# Altium schematic sheet Э2_diplom.SchDoc
size 420 x 297 mm; CheckedBy: Резчикова Е.В.; Author: Аракелян Г.Г.; CompanyName: ИУ4.11.03.03.25.01.82.08.001 Э2; Address1: Схема электрическая функциональная; SheetNumber: 2; SheetTotal: 3
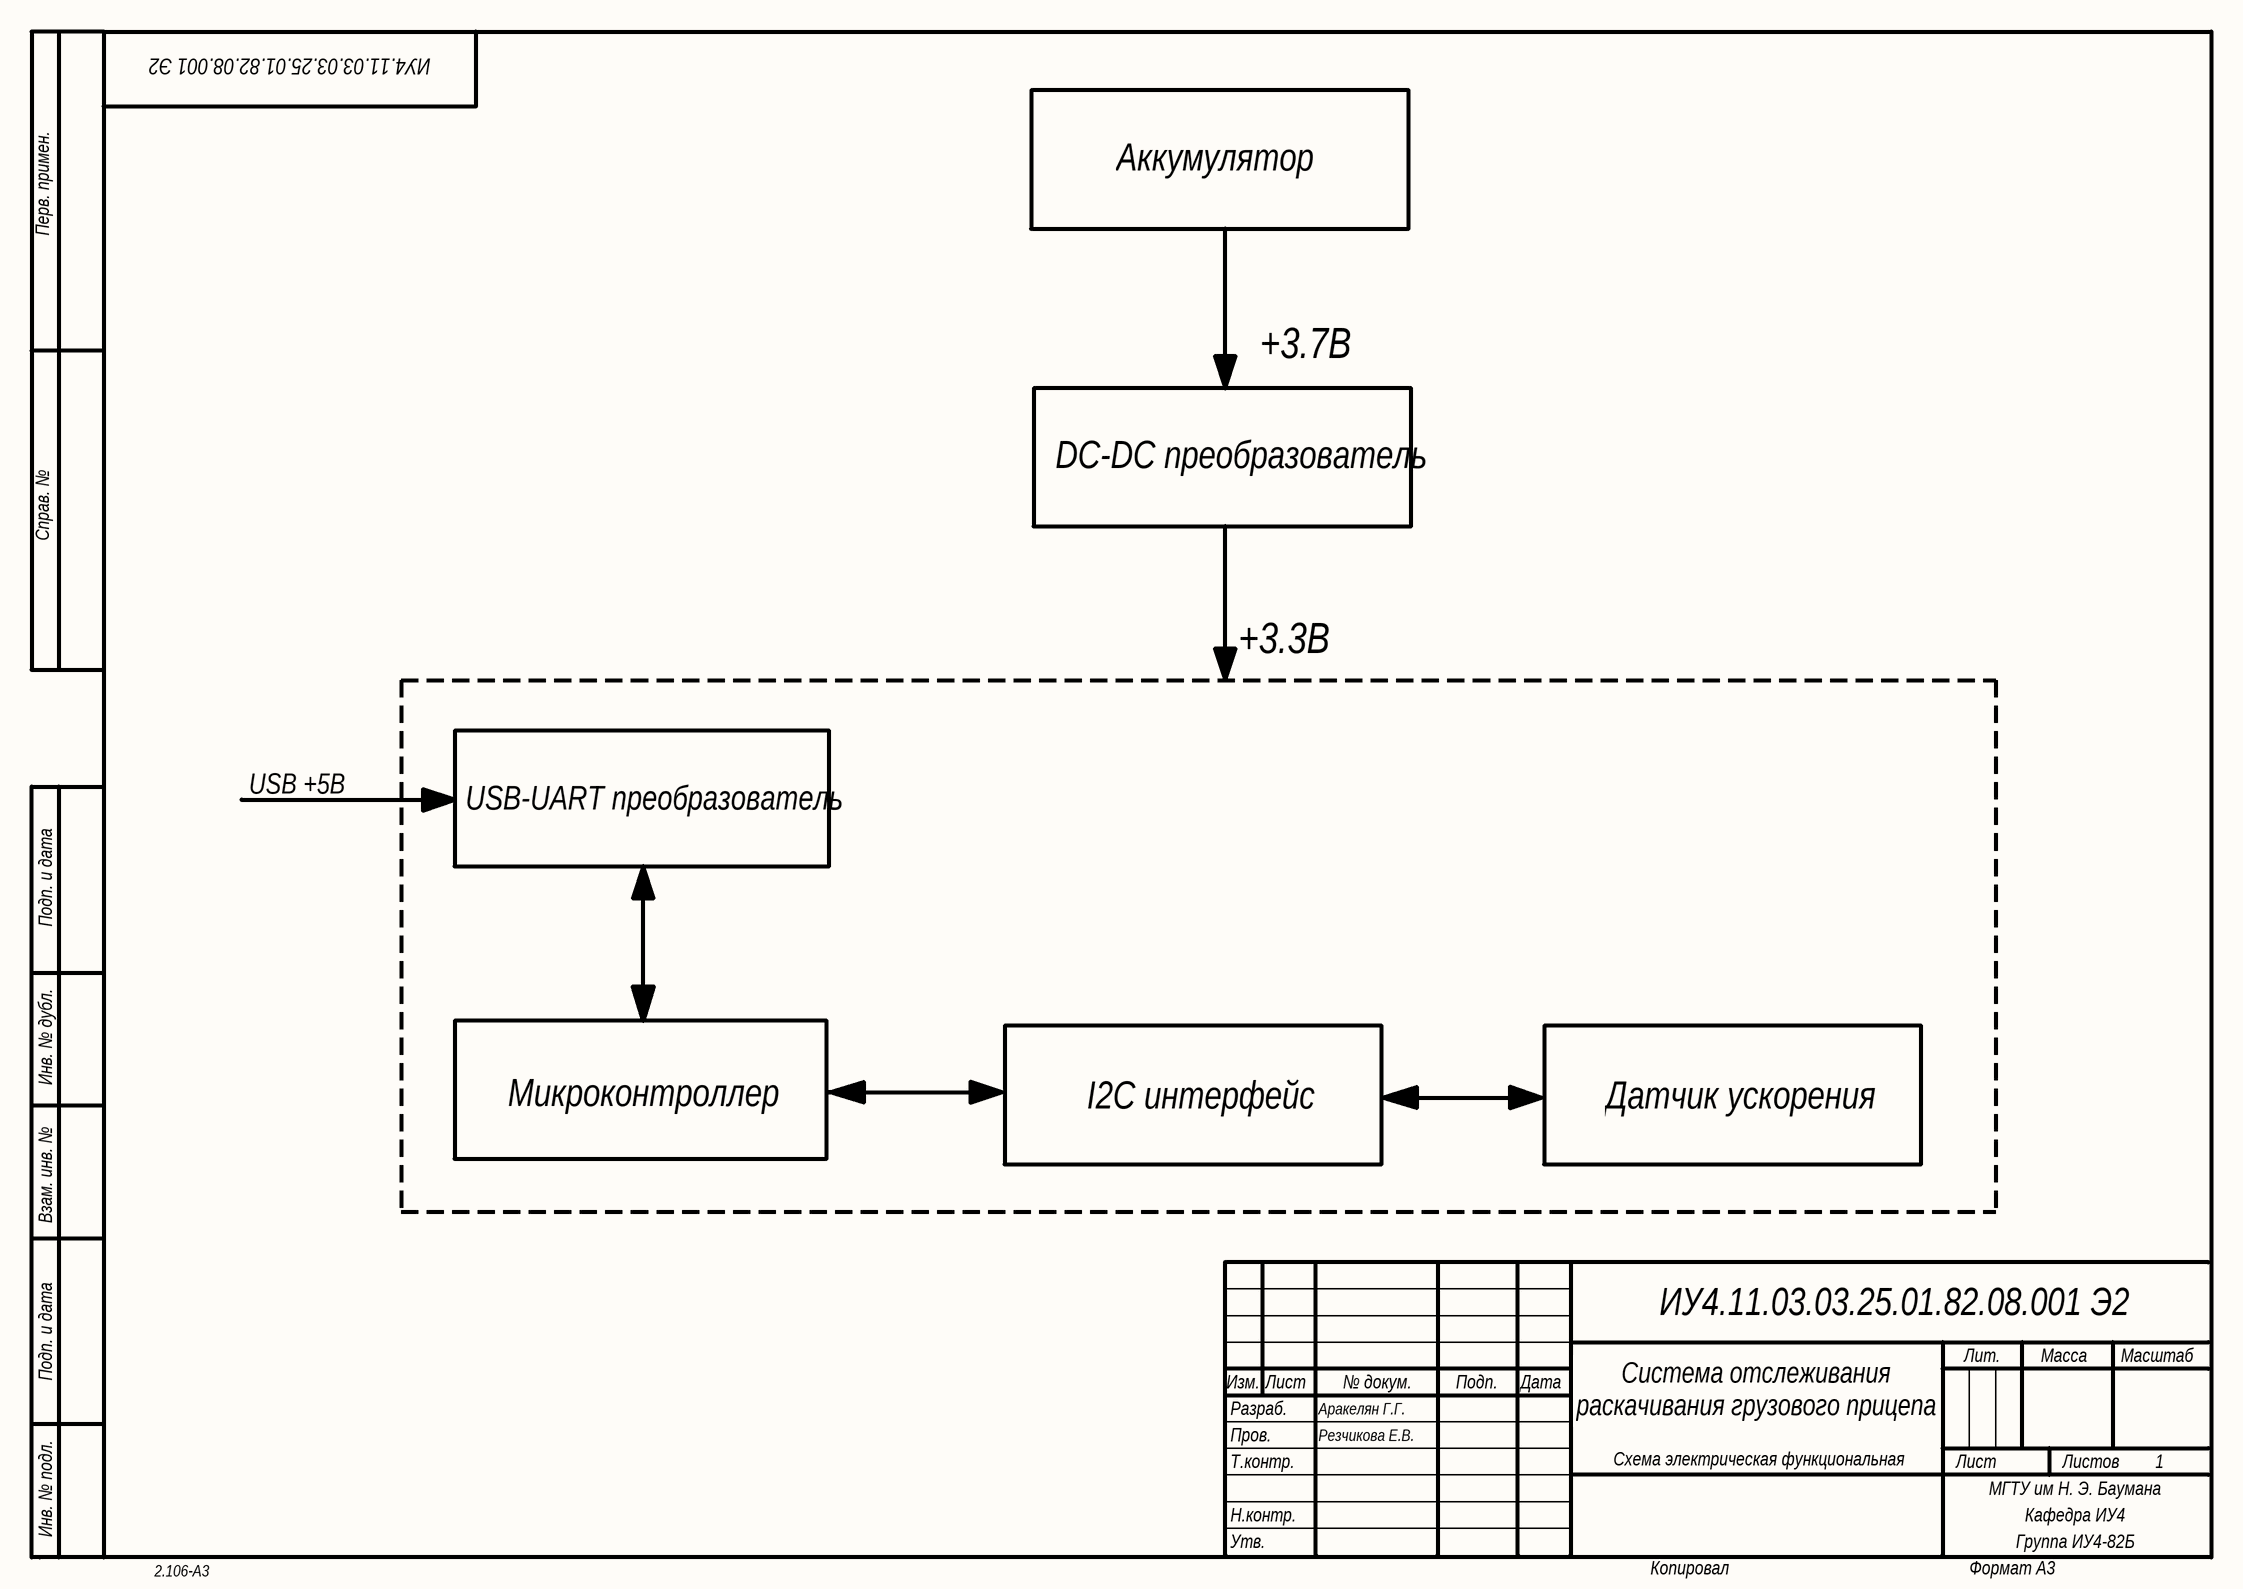
[diagram p0: Э2_diplom.SchDoc]

## Notes on the sheet
- Аккумулятор
- +3.7В
- DC-DC преобразователь
- +3.3В
- USB +5В
- USB-UART преобразователь
- Микроконтроллер
- I2C интерфейс
- Датчик ускорения
- Система отслеживания раскачивания грузового прицепа
- Перв. примен.
- Справ. №
- Подп. и дата
- Инв. № дубл.
- Взам. инв. №
- Разраб.
- Изм.
- Лист
- № докум.
- Подп.
- Дата
- Лит.
- Масса
- Масштаб
- Пров.
- Т.контр.
- Листов
- 1
- Инв. № подл.
- Утв.
- Н.контр.
- МГТУ им Н. Э. Баумана
- Группа ИУ4-82Б
- Кафедра ИУ4
- 2.106-A3
- Копировал
- Формат А3